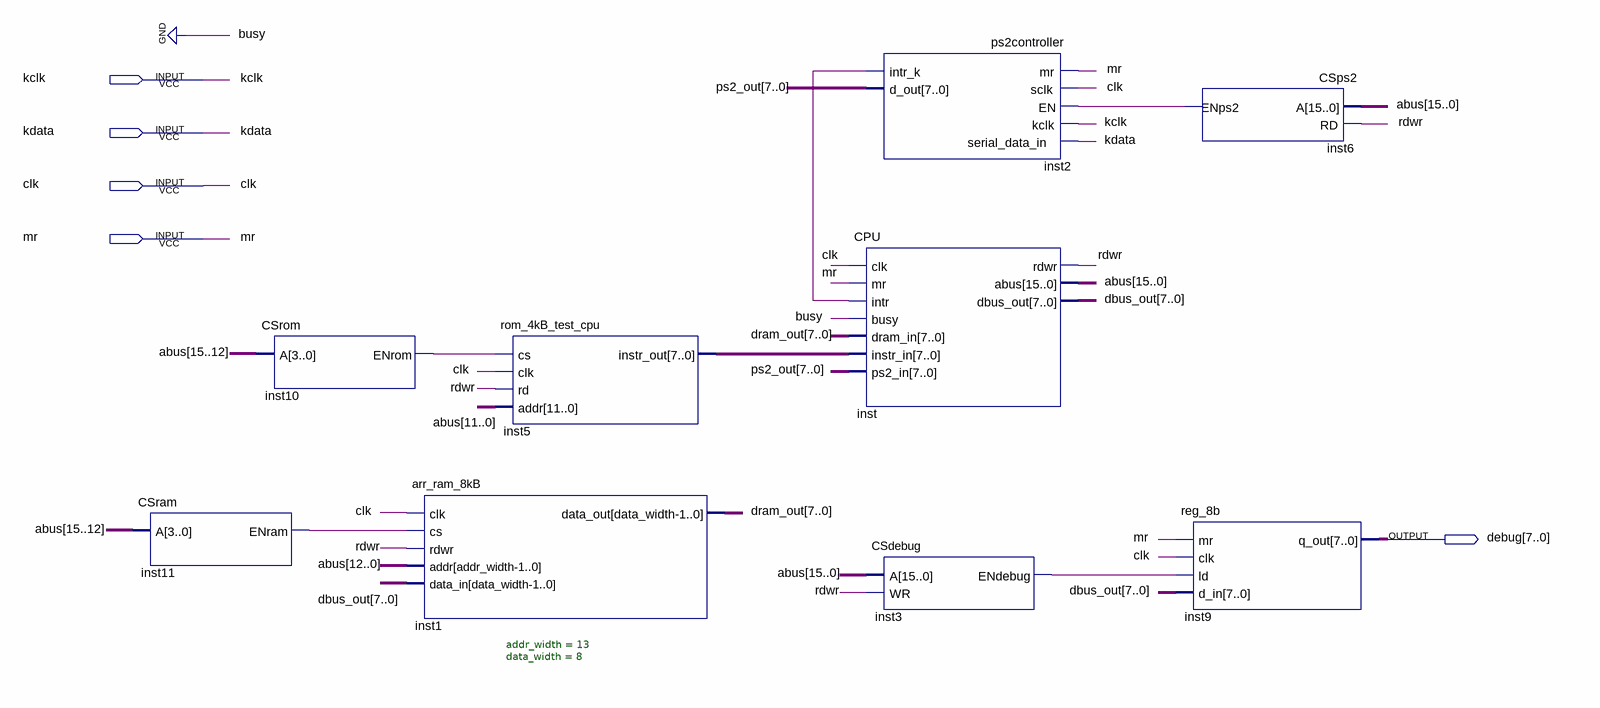
[diagram p0: schematic sheet]
// Quartus schematic TopLevel.bdf as structural Verilog: 9 symbols, 5 pins
module TopLevel (
  input  kclk,
  input  kdata,
  input  clk,
  input  mr,
  output [7:0] debug
);

  wire inst2_intr_k, inst3_endebug, inst6_enps2, inst10_enrom, inst11_enram, rdwr;
  wire [7:0] dbus_out, dram_out, inst5_instr_out, ps2_out;
  wire [15:0] abus;

  CSram inst11 (.A(abus[15:12]), .ENram(inst11_enram));
  CSrom inst10 (.A(abus[15:12]), .ENrom(inst10_enrom));
  arr_ram_8kB #(.addr_width(13), .data_width(8)) inst1 (
    .clk(clk), .cs(inst11_enram), .rdwr(rdwr), .addr(abus[12:0]), .data_in(dbus_out), .data_out(dram_out));
  rom_4kB_test_cpu inst5 (.cs(inst10_enrom), .clk(clk), .rd(rdwr), .addr(abus[11:0]), .instr_out(inst5_instr_out));
  ps2controller inst2 (
    .mr(mr), .sclk(clk), .EN(inst6_enps2), .kclk(kclk), .serial_data_in(kdata), .intr_k(inst2_intr_k),
    .d_out(ps2_out));
  CPU inst (
    .clk(clk), .mr(mr), .intr(inst2_intr_k), .busy(1'b0), .dram_in(dram_out), .instr_in(inst5_instr_out),
    .ps2_in(ps2_out), .rdwr(rdwr), .abus(abus), .dbus_out(dbus_out));
  CSdebug inst3 (.A(abus), .WR(rdwr), .ENdebug(inst3_endebug));
  reg_8b inst9 (.mr(mr), .clk(clk), .ld(inst3_endebug), .d_in(dbus_out), .q_out(debug));
  CSps2 inst6 (.A(abus), .RD(rdwr), .ENps2(inst6_enps2));
endmodule
